# Altium project steve_breakout.PrjPcb
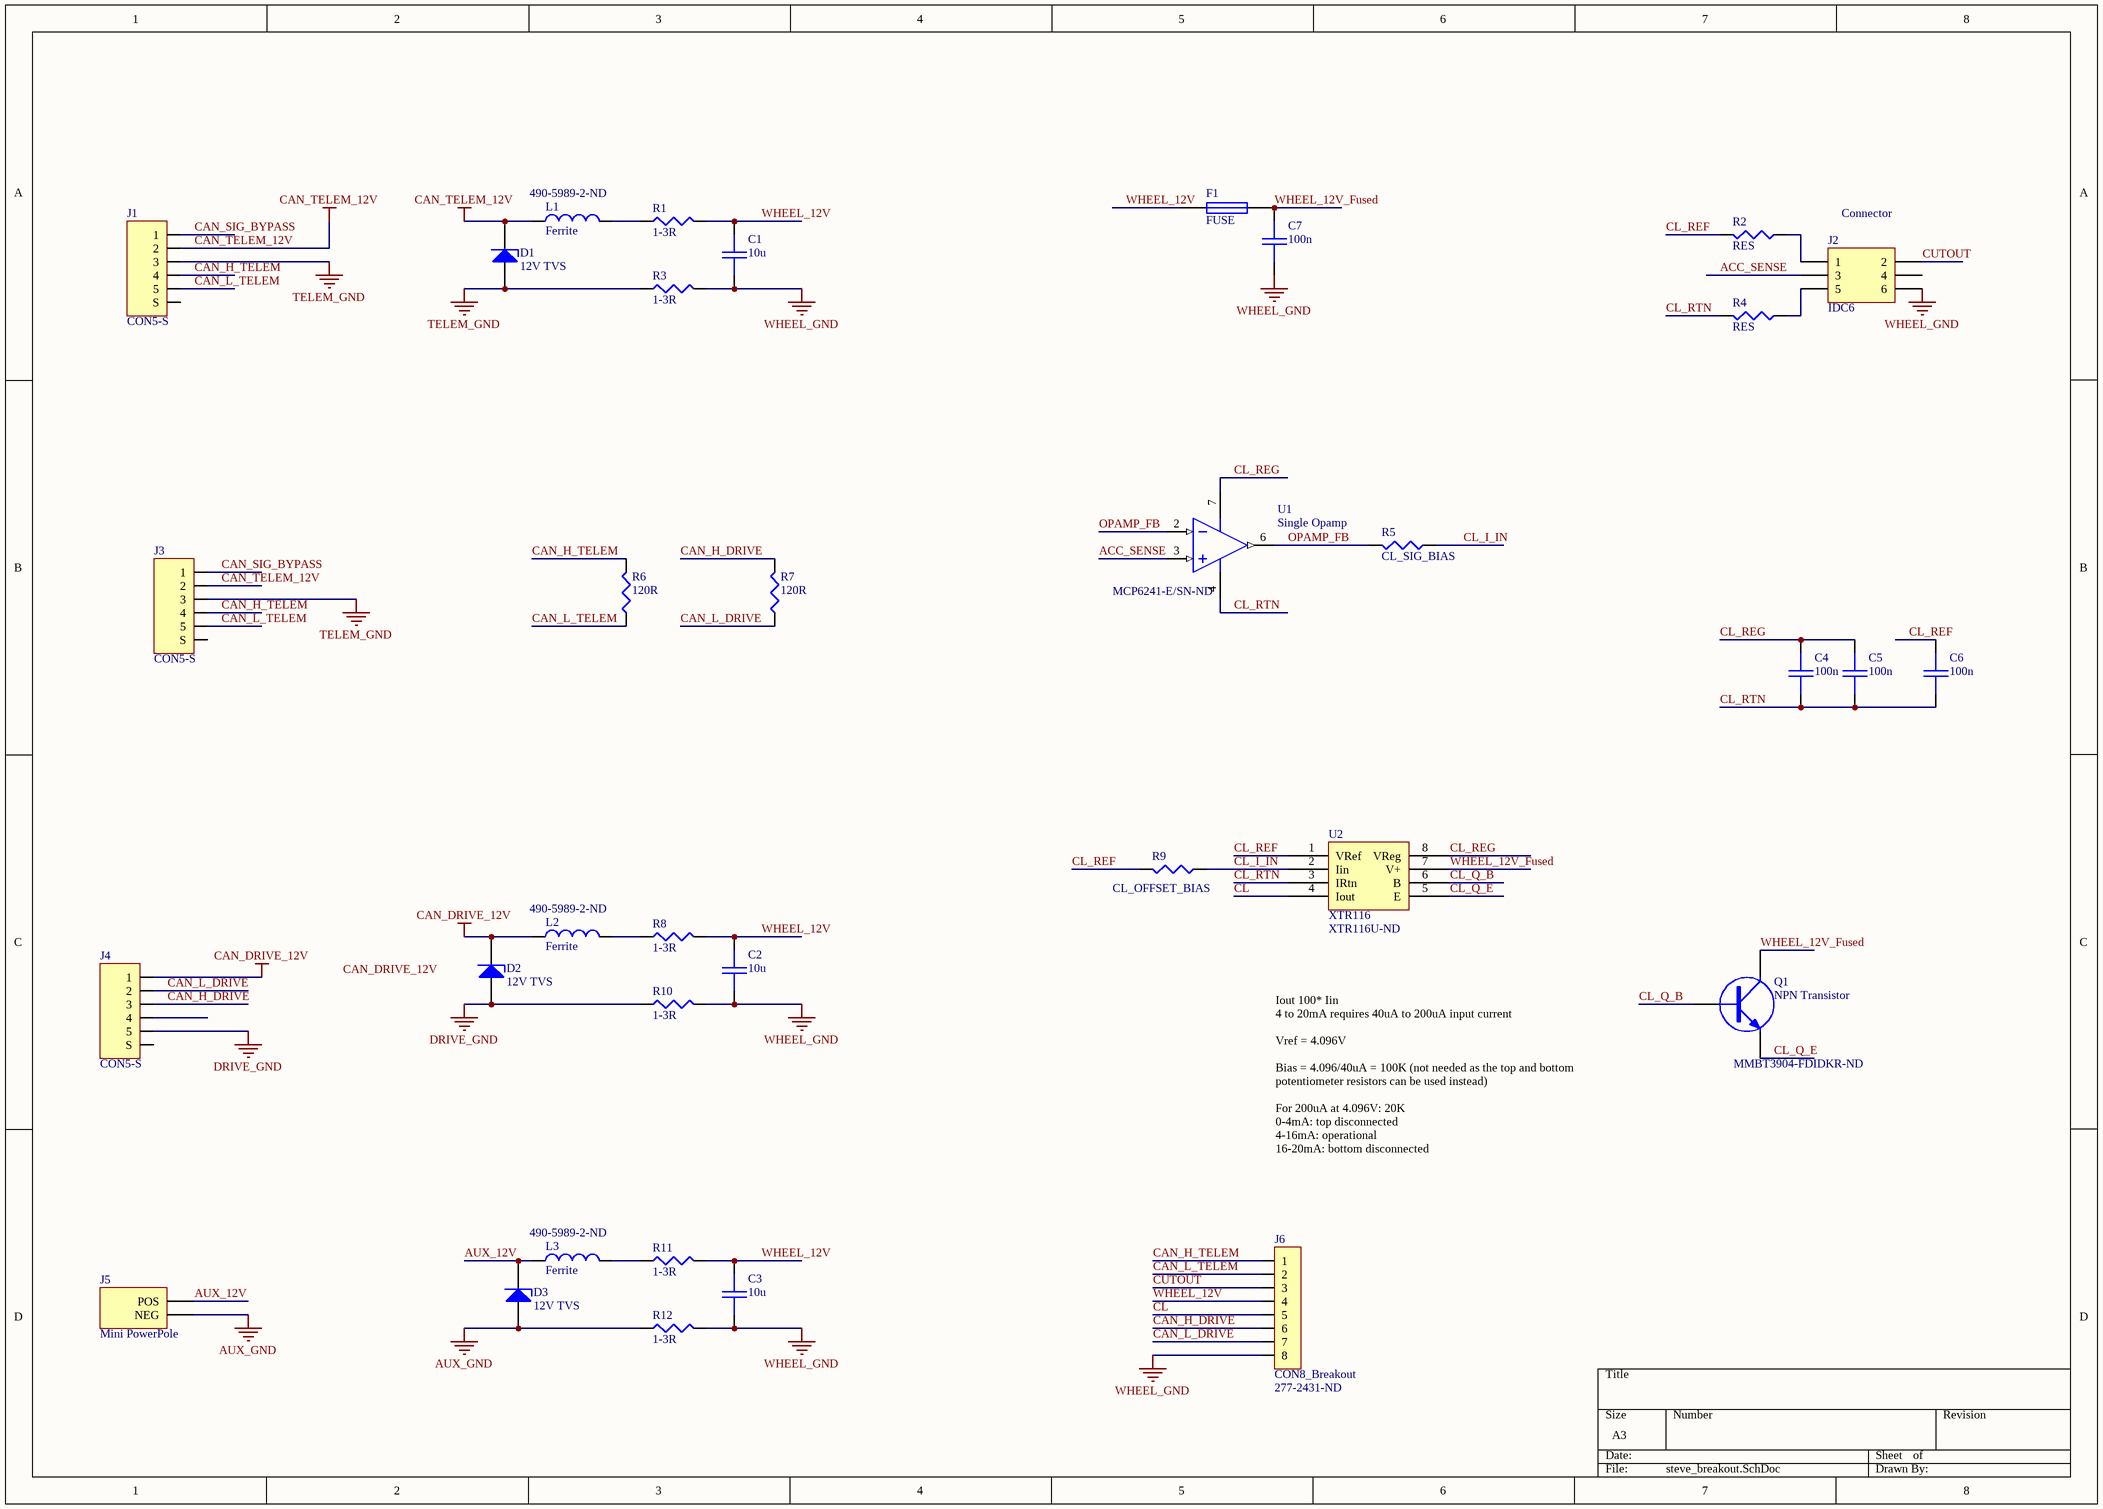
[diagram p0: steve_breakout.SchDoc]
1 sheet, 35 parts. Net scope: global (net labels, ports and power ports of the same name join across sheets).
Board file: steve_breakout.PcbDoc

## Sheet steve_breakout.SchDoc
size A3

### Parts
C1  10u  [1206]
C2  10u  [1206]
C3  10u  [1206]
C4  100n  [0603]
C5  100n  [0603]
C6  100n  [0603]
C7  100n  [0603]
D1  12V TVS  [SMB]
D2  12V TVS  [SMB]
D3  12V TVS  [SMB]
F1  FUSE  [LITTELFUSE-154]
J1  CON5-S  [TRIAD5F]
J2  IDC6  [IDC6]
J3  CON5-S  [TRIAD5F]
J4  CON5-S  [M12_5P]
J5  Mini PowerPole  [POWERPOLE25A-2]
J6  CON8_Breakout  [M12_8p]
L1  Ferrite  Supplier Part Number 1: 490-5989-2-ND  [1206]
L2  Ferrite  Supplier Part Number 1: 490-5989-2-ND  [1206]
L3  Ferrite  Supplier Part Number 1: 490-5989-2-ND  [1206]
Q1  NPN Transistor  Supplier Part Number 1: MMBT3904-FDIDKR-ND  [SOT23-3]
R1  1-3R  [1206]
R2  RES  [0603]
R3  1-3R  [1206]
R4  RES  [0603]
R5  CL_SIG_BIAS  [0603]
R6  120R  [0603]
R7  120R  [0603]
R8  1-3R  [1206]
R9  CL_OFFSET_BIAS  [0603]
R10  1-3R  [1206]
R11  1-3R  [1206]
R12  1-3R  [1206]
U1  Single Opamp  Supplier Part Number 1: MCP6241-E/SN-ND  [SO8]
U2  XTR116  Supplier Part Number 1: XTR116U-ND  [SO8]

### Nets
AUX_GND: D3.A J5.NEG R12.1
CAN_DRIVE_12V: D2.K J4.1 L2.1
CAN_TELEM_12V: D1.K J1.2 J3.2 L1.1
DRIVE_GND: D2.A J4.5 R10.1
TELEM_GND: D1.A J1.3 J3.3 R3.1
WHEEL_GND: C1.2 C2.2 C3.2 C7.2 J2.6 J6.8 R3.2 R10.2 R12.2
ACC_SENSE: J2.3 U1.3(IN+)
AUX_12V: D3.K J5.POS L3.1
CAN_H_DRIVE: J4.3 J6.6 R7.2
CAN_H_TELEM: J1.4 J3.4 J6.1 R6.2
CAN_L_DRIVE: J4.2 J6.7 R7.1
CAN_L_TELEM: J1.5 J3.5 J6.2 R6.1
CAN_SIG_BYPASS: J1.1 J3.1
CL: J6.5 U2.4(Iout)
CL_I_IN: R5.1 R9.1 U2.2(Iin)
CL_Q_B: Q1.1(B) U2.6(B)
CL_Q_E: Q1.2(E) U2.5(E)
CL_REF: C6.1 R2.2 R9.2 U2.1(VRef)
CL_REG: C4.1 C5.1 U1.7(V+) U2.8(VReg)
CL_RTN: C4.2 C5.2 C6.2 R4.2 U1.4(V+) U2.3(IRtn)
CUTOUT: J2.2 J6.3
OPAMP_FB: R5.2 U1.2(IN-) U1.6(OUT)
WHEEL_12V: C1.1 C2.1 C3.1 F1.1 J6.4 R1.2 R8.2 R11.2
WHEEL_12V_Fused: C7.1 F1.2 Q1.3(C) U2.7(V+)
NetJ2_1: J2.1 R2.1
NetJ2_5: J2.5 R4.1
NetL1_2: L1.2 R1.1
NetL2_2: L2.2 R8.1
NetL3_2: L3.2 R11.1

Not connected (* = marked no-connect by the designer): J1 0(S); J2 4; J3 0(S); J4 0(S) 4

### Notes on the sheet
- (near J2) Connector
- Iout 100* Iin
  4 to 20mA requires 40uA to 200uA input current
  Vref = 4.096V
  Bias = 4.096/40uA = 100K (not needed as the top and bottom potentiometer resistors can be used instead)
  For 200uA at 4.096V: 20K
  0-4mA: top disconnected
  4-16mA: operational
  16-20mA: bottom disconnected
- Labels drawn without touching a wire or pin: CAN_DRIVE_12V

### Library data of the parts
C1-C7 = CAP: Capacitor
D1-D3 = ZENER1: Zener Diode
J1 J3 J4 = CON5-S: Connector, 2 pin, with shield @ S
J2 = IDC6: Connector
J5 = PowerPole
J6 = CON8_Breakout: 277-2431-ND; Supplier 1: Digi-Key; Supplier Part Number 1: 277-2431-ND
L1-L3 = INDUCTOR: Manufacturer: Generic Components; Manufacturer Part Number: BLM31PG330SN1L; Class I: Passive; Value: 10mH; Description: FERRITE CHIP 33 OHM 6A 1206; Impedance @ Frequency: 33 Ohm @ 100MHz; Current Rating: 6A; DC Resistance (DCR): 9 mOhm Max; Filter Type: Differential Mode - Single; Published: 8-Jun-2000; Revision: July-2002: Re-released for DXP Platform.; Publisher: Altium Limited; Class II: Inductor; Supplier 1: Digi-Key; RoHS: RoHS Compliant; Category: Filters; Stock 1: 18000; Pricing 1: 3000=0.10516, 6000=0.1014, 9000=0.09652, 15000=0.09389 (AUD); Packaging: Tape & Reel (TR); Package / Case: 1206 (3216 Metric); Mounting Type: Surface Mount; Height (Max): 0.051" (1.30mm); Size / Dimension: 0.126" L x 0.063" W (3.20mm x 1.60mm); ComponentLink1URL: http://search.murata.co.jp/Ceramy/image/img/PDF/ENG/L0132S0193BLM31P.pdf; ComponentLink1Description: http://search.murata.co.jp/Ceramy/image/img/PDF/ENG/L0132S0193BLM31P.pdf
Q1 = NPN Transistor: Manufacturer: Diodes Inc; Manufacturer Part Number: MMBT3904-7-F; Description: TRANS NPN 40V 350MW SMD SOT23-3; Current - Collector (Ic) (Max): 200mA; Voltage - Collector Emitter Breakdown (Max): 40V; Vce Saturation (Max) @ Ib, Ic: 300mV @ 5mA, 50mA; DC Current Gain (hFE) (Min) @ Ic, Vce: 100 @ 10mA, 1V; Power - Max: 300mW; Frequency - Transition: 300MHz; Supplier 1: Digi-Key; RoHS: RoHS Compliant; Category: Discrete Semiconductor Products; Stock 1: 181031; Pricing 1: 1=0.14, 10=0.136, 25=0.124, 100=0.0892, 250=0.05248, 500=0.04356, 1000=0.02971 (AUD); Packaging: Digi-Reel®; Transistor Type: NPN; Current - Collector Cutoff (Max): -; Mounting Type: Surface Mount; Package / Case: TO-236-3, SC-59, SOT-23-3; Supplier Device Package: SOT-23-3; ComponentLink1URL: http://www.diodes.com/datasheets/ds30036.pdf; ComponentLink1Description: http://www.diodes.com/datasheets/ds30036.pdf
R1-R12 = RES1: Resistor
U1 = Single Opamp: Manufacturer: Microchip Technology; Manufacturer Part Number: MCP6241-E/SN; Description: IC OPAMP SNGL 1.8V 550KHZ 8SOIC; Amplifier Type: General Purpose; Number of Circuits: 1; Output Type: Rail-to-Rail; Slew Rate: 0.3 V/µs; Gain Bandwidth Product: 550kHz; Current - Input Bias: 1pA; Voltage - Input Offset: 5mV; Current - Supply: 50µA; Current - Output / Channel: 23mA; Voltage - Supply, Single/Dual (±): 1.8 V ~ 5.5 V; Supplier 1: Digi-Key; RoHS: RoHS Compliant; Category: Integrated Circuits (ICs); Stock 1: 1760; Pricing 1: 1=0.43, 10=0.361, 25=0.3004, 100=0.2764 (AUD); Packaging: Tube; -3db Bandwidth: -; Operating Temperature: -40°C ~ 125°C; Mounting Type: Surface Mount; Package / Case: 8-SOIC (0.154", 3.90mm Width); Supplier Device Package: 8-SOIC N; ComponentLink1URL: http://ww1.microchip.com/downloads/en/DeviceDoc/21882d.pdf; ComponentLink1Description: http://ww1.microchip.com/downloads/en/DeviceDoc/21882d.pdf
U2 = XTR116: 4-20mA Current loop transmitter; Manufacturer: Texas Instruments; Manufacturer Part Number: XTR116U; Description: IC 4 TO 20MA TRANSMITTER 8-SOIC; Input Type: Voltage; Interface: 2-Wire; Current - Supply: 20mA; Supplier 1: Digi-Key; RoHS: RoHS Compliant; Category: Integrated Circuits (ICs); Stock 1: 1861; Pricing 1: 1=5.3, 25=4.2588, 100=3.8804, 250=3.50176, 500=3.1421, 750=2.83925, 1000=2.64996 (AUD); Packaging: Tube; Type: Current Transmitter; Output Type: Voltage; Mounting Type: Surface Mount; Package / Case: 8-SOIC (0.154", 3.90mm Width); Supplier Device Package: 8-SOIC; ComponentLink1URL: http://www.ti.com/lit/ds/symlink/xtr115.pdf; ComponentLink1Description: http://www.ti.com/lit/ds/symlink/xtr115.pdf